# Altium schematic sheet TermoDeep.SchDoc: Termodeep
size A4; Revision: V1.10 Rev A; Proyect DSD: Termodeep; Version: V 1.0  Rev A
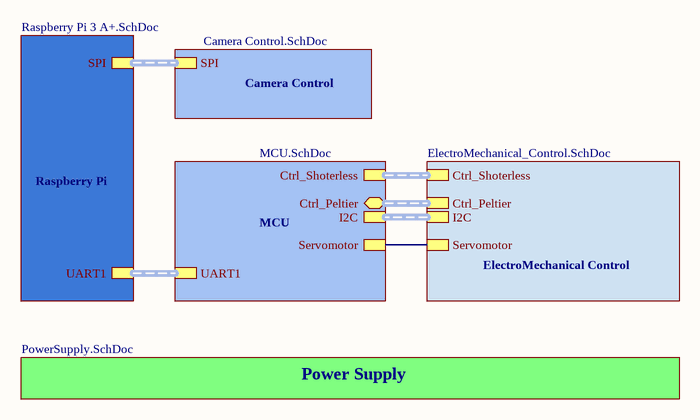
[diagram p0: TermoDeep.SchDoc]

## Sub-sheets
Camera Control = Camera Control.SchDoc: SPI (harness SPI)
ElectroMechanical Control = ElectroMechanical_Control.SchDoc: Ctrl_Peltier (harness Ctrl_Peltier), Ctrl_Shoterless (harness Ctrl_Shoterless), Servomotor, I2C (harness I2C)
MCU = MCU.SchDoc: Ctrl_Peltier (bidir, harness Ctrl_Peltier), Ctrl_Shoterless (harness Ctrl_Shoterless), Servomotor, UART1 (harness UART1), I2C
Power Supply = PowerSupply.SchDoc: no entries
Raspberry Pi = Raspberry Pi 3 A+.SchDoc: UART1 (harness UART1), SPI (harness SPI)

## Nets
(unnamed): sheet MCU/Servomotor, sheet ElectroMechanical Control/Servomotor

## Buses and harness runs
harness sheet Camera Control/SPI = sheet Raspberry Pi/SPI
harness sheet ElectroMechanical Control/Ctrl_Peltier = sheet MCU/Ctrl_Peltier
harness sheet ElectroMechanical Control/Ctrl_Shoterless = sheet MCU/Ctrl_Shoterless
harness sheet ElectroMechanical Control/I2C = sheet MCU/I2C
harness sheet MCU/UART1 = sheet Raspberry Pi/UART1

## Notes on the sheet
- Title
- Size:
- Date:
- A4
- Version
- Sheet
- of
- DeepSea Developments
- Cll  2A # 24C - 25
- Cali, Valle del Cauca
- Colombia
- www.dsd.dev
- Proyect: